# Altium schematic sheet PhaseALeg.SchDoc: Phase A
size A4; DrawnBy: Jarod Krane; Organization: Altium Limited; Address1: L3, 12a Rodborough Rd; Address2: Frenchs Forest; Address3: NSW; Address4: Australia 2086; Revision: 0; SheetNumber: 2; SheetTotal: 11
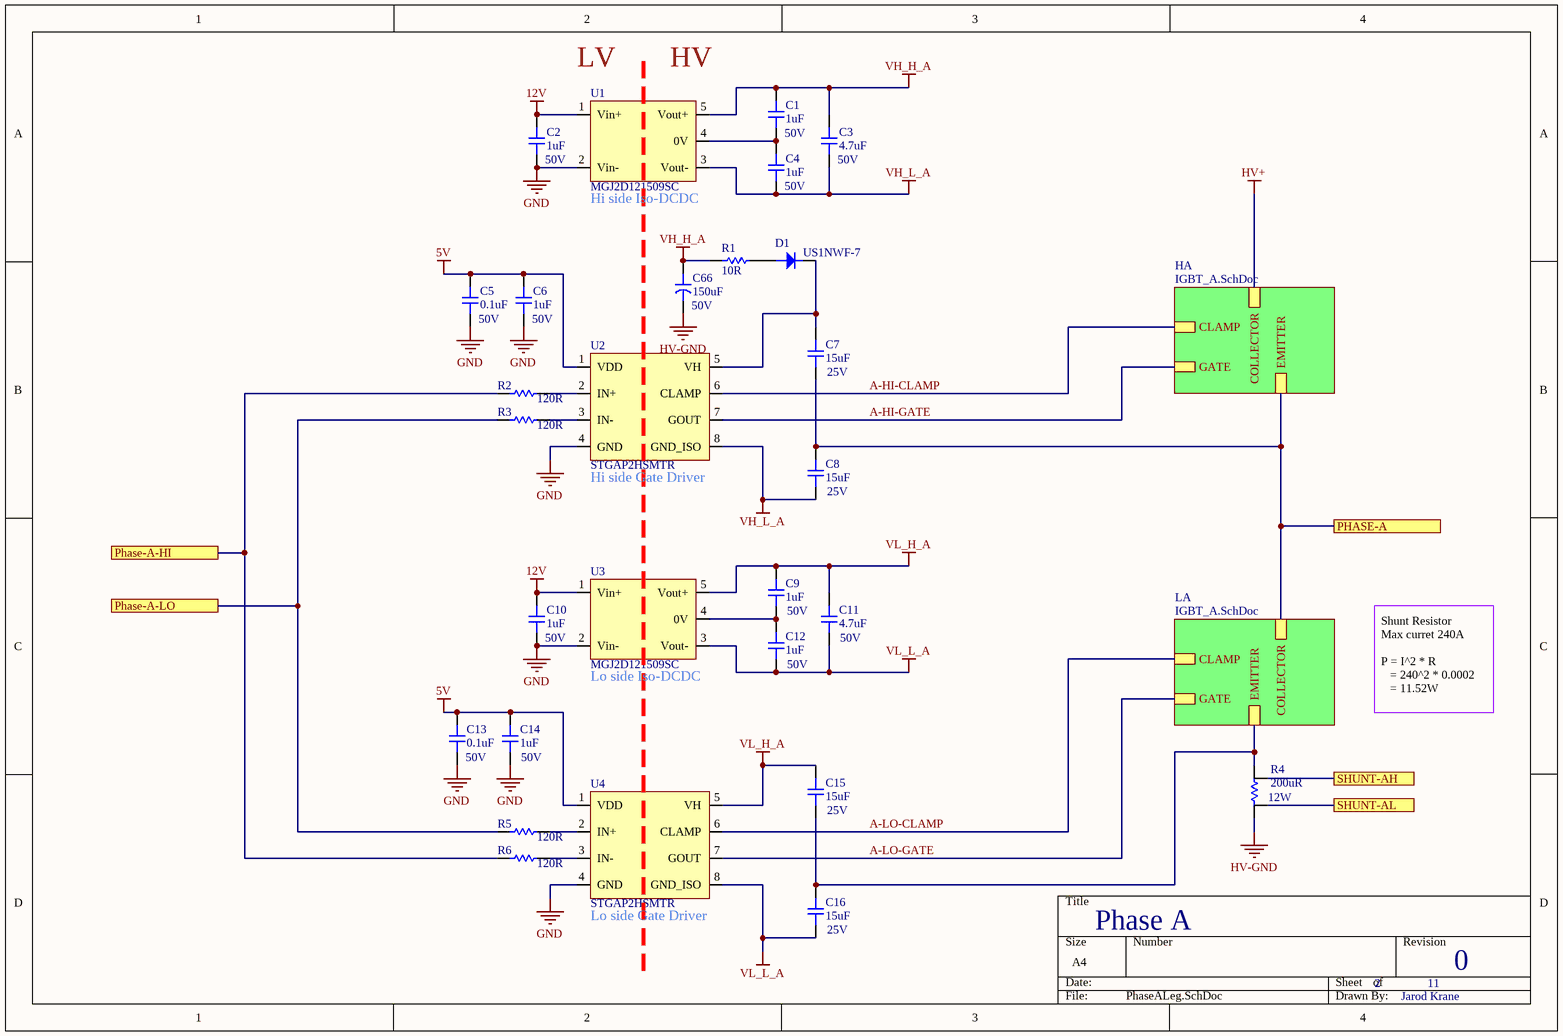
[diagram p0: PhaseALeg.SchDoc]

## Parts
C1  1uF  Voltage Rating: 50V  [CAP-0805]
C2  1uF  Voltage Rating: 50V  [CAP-0805]
C3  4.7uF  Voltage Rating: 50V  [CAP-1206]
C4  1uF  Voltage Rating: 50V  [CAP-0805]
C5  0.1uF  Voltage: 50V  [CAP-0805]
C6  1uF  Voltage Rating: 50V  [CAP-0805]
C7  15uF  Voltage: 25V  [CAP-1812]
C8  15uF  Voltage: 25V  [CAP-1812]
C9  1uF  Voltage Rating: 50V  [CAP-0805]
C10  1uF  Voltage Rating: 50V  [CAP-0805]
C11  4.7uF  Voltage Rating: 50V  [CAP-1206]
C12  1uF  Voltage Rating: 50V  [CAP-0805]
C13  0.1uF  Voltage: 50V  [CAP-0805]
C14  1uF  Voltage Rating: 50V  [CAP-0805]
C15  15uF  Voltage: 25V  [CAP-1812]
C16  15uF  Voltage: 25V  [CAP-1812]
C66  150uF  Voltage: 50V  [CAPCAN-10mm]
D1  US1NWF-7  [DIOM2718X12N]
R1  10R  [RES-0603]
R2  120R  [RES-0603]
R3  120R  [RES-0603]
R4  200uR  Power: 12W  [RES-SHUNT]
R5  120R  [RES-0603]
R6  120R  [RES-0603]
U1  MGJ2D121509SC  [MGJ2]
U2  STGAP2HSMTR  [SO-8W]
U3  MGJ2D121509SC  [MGJ2]
U4  STGAP2HSMTR  [SO-8W]

## Sub-sheets
HA = IGBT_A.SchDoc: COLLECTOR, EMITTER, GATE, CLAMP
LA = IGBT_A.SchDoc: COLLECTOR, EMITTER, GATE, CLAMP

## Ports
PHASE-A, Phase-A-HI, Phase-A-LO, SHUNT-AH, SHUNT-AL

## Nets
5V: C5.2 C6.2 C13.2 C14.2 U2.1(VDD) U4.1(VDD)
12V: C2.2 C10.2 U1.1(Vin+) U3.1(Vin+)
GND: C2.1 C5.1 C6.1 C10.1 C13.1 C14.1 U1.2(Vin-) U2.4(GND) U3.2(Vin-) U4.4(GND)
HV+: sheet HA/COLLECTOR
HV-GND: C66.2 R4.1
VH_H_A: C1.2 C3.2 C66.1 R1.1 U1.5(Vout+)
VH_L_A: C3.1 C4.1 C8.1 U1.3(Vout-) U2.8(GND_ISO)
VL_H_A: C9.2 C11.2 C15.2 U3.5(Vout+) U4.5(VH)
VL_L_A: C11.1 C12.1 C16.1 U3.3(Vout-) U4.8(GND_ISO)
A-HI-CLAMP: U2.6(CLAMP) ; sheet HA/CLAMP
A-HI-GATE: U2.7(GOUT) ; sheet HA/GATE
A-LO-CLAMP: U4.6(CLAMP) ; sheet LA/CLAMP
A-LO-GATE: U4.7(GOUT) ; sheet LA/GATE
PHASE-A: C7.1 C8.2 ; port PHASE-A, sheet HA/EMITTER, sheet LA/COLLECTOR
Phase-A-HI: R2.1 R6.1 ; port Phase-A-HI
Phase-A-LO: R3.1 R5.1 ; port Phase-A-LO
SHUNT-AH: R4.4 ; port SHUNT-AH
SHUNT-AL: R4.3 ; port SHUNT-AL
NetC1_1: C1.1 C4.2 U1.4(0V)
NetC7_2: C7.2 D1.1 U2.5(VH)
NetC9_1: C9.1 C12.2 U3.4(0V)
NetC15_1: C15.1 C16.2 R4.2 ; sheet LA/EMITTER
NetD1_2: D1.2 R1.2
NetR2_2: R2.2 U2.2(IN+)
NetR3_2: R3.2 U2.3(IN-)
NetR5_2: R5.2 U4.2(IN+)
NetR6_2: R6.2 U4.3(IN-)

## Notes on the sheet
- (near U1) LV
- (near U1) HV
- (near U1) Hi side Iso-DCDC
- (near U2) Hi side Gate Driver
- (near U3) Lo side Iso-DCDC
- Shunt Resistor
  Max curret 240A
  P = I^2 * R
  = 240^2 * 0.0002
  = 11.52W
- (near U4) Lo side Gate Driver
- Title
- Size:
- Date:
- A4
- Number:
- Time:
- Revision:
- Sheet
- of
- File:

## Library data of the parts
C1 C2 C4 C6 C9 C10 C12 C14 = 0805-1uF-50V: CAP CER 1UF 50V X5R 0805; Manufacturer: KEMET; Manufacturer Part Number: C0805C105K5PACTU; Dielectric Material: Ceramic; Tolerance: 10%; Supplier 1: Digi-Key; Stock 1: 7193; Pricing 1: 1=0.33, 10=0.23, 100=0.1378, 500=0.10334, 1000=0.08726 (USD); Mount: Surface Mount; Case/Package: 0805; Weight: 0.000194oz; Case Code (Metric): 2012; Case Code (Imperial): 0805; Min Operating Temperature: -55°C; Max Operating Temperature: 85°C; Dielectric: X5R; Packaging: Tape and Reel; Termination: SMD/SMT; Voltage Rating (DC): 50V; Package Quantity: 2500; Capacitance: 1uF; Length: 0.079inch; Width: 0.049inch; Thickness: 0.055inch; REACH SVHC: No SVHC; Lead Free: Lead Free; ComponentLink1URL: https://api.kemet.com/component-edge/download/datasheet/C0805C105K5PAC7800.pdf?src-supplier=Digi-Key; ComponentLink1Description: https://api.kemet.com/component-edge/download/datasheet/C0805C105K5PAC7800.pdf?src-supplier=Digi-Key; ComponentLink2URL: http://www.farnell.com/datasheets/2746140.pdf?src-supplier=Farnell; ComponentLink2Description: http://www.farnell.com/datasheets/2746140.pdf?src-supplier=Farnell; ComponentLink3URL: http://www.mouser.com/ds/2/212/KEM_C1006_X5R_SMD-1103249.pdf?src-supplier=Mouser; ComponentLink3Description: http://www.mouser.com/ds/2/212/KEM_C1006_X5R_SMD-1103249.pdf?src-supplier=Mouser; ComponentLink4URL: http://www.farnell.com/datasheets/2746140.pdf?src-supplier=Newark; ComponentLink4Description: http://www.farnell.com/datasheets/2746140.pdf?src-supplier=Newark; ComponentLink5URL: http://www.farnell.com/datasheets/2032728.pdf?src-supplier=Element14; ComponentLink5Description: http://www.farnell.com/datasheets/2032728.pdf?src-supplier=Element14; Supplier Part Number 1: 399-15436-6-ND
C3 C11 = 1206-4.7uF-50V: CAP CER 4.7UF 50V X7R 1206; Manufacturer: TDK; Manufacturer Part Number: C3216X7R1H475K160AC; Dielectric Material: Ceramic; Tolerance: 10%; Supplier 1: Digi-Key; Stock 1: 117540; Pricing 1: 1=0.76, 10=0.535, 50=0.4042, 100=0.3521, 500=0.26082, 1000=0.2217 (USD); Mount: Surface Mount; Case/Package: 1206; Case Code (Metric): 3216; Case Code (Imperial): 1206; Weight: 0.000571oz; Min Operating Temperature: -55°C; Max Operating Temperature: 125°C; Capacitance: 4.7uF; Packaging: Tape and Reel; Voltage Rating (DC): 50V; Termination: SMD/SMT; Series: C; Package Quantity: 1; Dielectric: X7R; Resistor Type: Ceramic; Length: 3.2mm; Width: 0.063inch; Depth: 1.6mm; Thickness: 1.6mm; REACH SVHC: No SVHC; Lead Free: Lead Free; RoHS Compliant: Yes; ComponentLink1URL: https://product.tdk.com/info/en/catalog/datasheets/mlcc_commercial_general_en.pdf?src-supplier=Digi-Key; ComponentLink1Description: https://product.tdk.com/info/en/catalog/datasheets/mlcc_commercial_general_en.pdf?src-supplier=Digi-Key; ComponentLink2URL: http://www.mouser.com/ds/2/400/lcc_commercial_general_en-560200.pdf?src-supplier=Mouser; ComponentLink2Description: http://www.mouser.com/ds/2/400/lcc_commercial_general_en-560200.pdf?src-supplier=Mouser; ComponentLink3URL: http://product.tdk.com/capacitor/mlcc/en/documents/mlcc_commercial_general_en.pdf?src-supplier=Future+Electronics; ComponentLink3Description: http://product.tdk.com/capacitor/mlcc/en/documents/mlcc_commercial_general_en.pdf?src-supplier=Future+Electronics; Supplier Part Number 1: 445-8032-6-ND
C5 C13 = 0805-0.1uF-50V: CAP CER 0.1UF 50V Y5V 0805; Manufacturer: KEMET; Manufacturer Part Number: C0805C104Z5VACTU; Dielectric Material: Ceramic; Capacitance: 100nF; Tolerance: 80%; Dissipation Factor: 5%; Supplier 1: Digi-Key; Stock 1: 929243; Pricing 1: 1=0.1, 10=0.057, 100=0.0254, 500=0.01818, 1000=0.01428 (USD); Mount: Surface Mount,PCB; Case/Package: 0805; Number of Pins: 2; Case Code (Metric): 2012; Case Code (Imperial): 0805; Min Operating Temperature: -30°C; Max Operating Temperature: 85°C; Package Quantity: 1; Voltage Rating: 50V; Packaging: Tape and Reel; Voltage Rating (DC): 50V; Dielectric: Y5V; Termination: SMD/SMT; Length: 2mm; Height: 0.9mm; Lead Pitch: 0.75mm; Width: 0.049inch; Thickness: 0.039inch; Depth: 1.25mm; Radiation Hardening: No; REACH SVHC: No SVHC; Lead Free: Lead Free; ComponentLink1URL: http://www.alliedelec.com/m/d/9bfe7773041ffe9d406e68bc7b377fdd.pdf?src-supplier=Allied+Electronics; ComponentLink1Description: http://www.alliedelec.com/m/d/9bfe7773041ffe9d406e68bc7b377fdd.pdf?src-supplier=Allied+Electronics; ComponentLink2URL: https://www.verical.com/server-webapp/html/getDatasheet?partID=37101&src-supplier=Verical; ComponentLink2Description: https://www.verical.com/server-webapp/html/getDatasheet?partID=37101&src-supplier=Verical; ComponentLink3URL: https://www.verical.com/server-webapp/html/getDatasheet?partID=321176&src-supplier=Verical; ComponentLink3Description: https://www.verical.com/server-webapp/html/getDatasheet?partID=321176&src-supplier=Verical; ComponentLink4URL: http://www.farnell.com/datasheets/2123124.pdf?src-supplier=Element14; ComponentLink4Description: http://www.farnell.com/datasheets/2123124.pdf?src-supplier=Element14; Supplier Part Number 1: 399-1177-6-ND
C7 C8 C15 C16 = 1812-15uF-25V: CAP CER 15UF 25V X7R 1812; Manufacturer: TDK; Manufacturer Part Number: C4532X7R1E156M280KB; Dielectric Material: Ceramic; Tolerance: 20%; Supplier 1: Digi-Key; Stock 1: 9166; Pricing 1: 1=1.18, 10=0.932, 50=0.8072, 100=0.6986 (USD); Mount: Surface Mount; Case/Package: 1812; Number of Pins: 2; Case Code (Imperial): 1812; Case Code (Metric): 4532; Weight: 0.000952oz; Min Operating Temperature: -55°C; Max Operating Temperature: 125°C; Voltage Rating: 25V; Capacitance: 15uF; Voltage Rating (DC): 25V; Packaging: Tape and Reel; Dielectric: X7R; Termination: SMD/SMT; Package Quantity: 1; Resistor Type: Ceramic; Series: C; Length: 4.5mm; Width: 0.126inch; Height: 2.8mm; Depth: 3.2mm; Thickness: 0.122inch; RoHS Compliant: Yes; Lead Free: Lead Free; REACH SVHC: No SVHC; ComponentLink1URL: http://www.farnell.com/datasheets/1913358.pdf?src-supplier=Element14; ComponentLink1Description: http://www.farnell.com/datasheets/1913358.pdf?src-supplier=Element14; ComponentLink2URL: https://product.tdk.com/info/en/documents/chara_sheet/C4532X7R1E156M280KB.pdf?src-supplier=Digi-Key; ComponentLink2Description: https://product.tdk.com/info/en/documents/chara_sheet/C4532X7R1E156M280KB.pdf?src-supplier=Digi-Key; ComponentLink3URL: https://product.tdk.com/en/products/common/pdf/mlcc_partnumber_description.pdf?src-supplier=Digi-Key; ComponentLink3Description: https://product.tdk.com/en/products/common/pdf/mlcc_partnumber_description.pdf?src-supplier=Digi-Key; ComponentLink4URL: http://uk.rs-online.com/webdocs/1532/0900766b81532cd0.pdf?src-supplier=RSComponents; ComponentLink4Description: http://uk.rs-online.com/webdocs/1532/0900766b81532cd0.pdf?src-supplier=RSComponents; ComponentLink5URL: http://www.tdk.com/pdf/general_B11.pdf?src-supplier=Future+Electronics; ComponentLink5Description: http://www.tdk.com/pdf/general_B11.pdf?src-supplier=Future+Electronics; Supplier Part Number 1: 445-3921-6-ND
C66 = 10mm-150uF-50V: CAP POLYMER HYBRID 150UF 50V SMD; Manufacturer: Panasonic; Manufacturer Part Number: EEHZS1H151P; Supplier 1: Digi-Key; Stock 1: 1212; Pricing 1: 1=2.07, 10=1.673, 50=1.46, 100=1.2775 (USD); Supplier Part Number 1: 10-EEH-ZS1H151PDKR-ND
D1 = Diode 1.2KV-1A: DIODE GEN PURP 1.2KV 1A SOD123F; Manufacturer: Diodes; Reverse Recovery Time: 80ns; Supplier 1: Digi-Key; Manufacturer Part Number: US1NWF-7; Stock 1: 33557; Pricing 1: 1=0.54, 10=0.438, 100=0.2985, 500=0.22388, 1000=0.1679 (USD); Mount: Surface Mount; Packaging: Tape and Reel; Max Reverse Voltage (DC): 1.2kV; Average Rectified Current: 1A; ComponentLink1URL: https://www.diodes.com/assets/Datasheets/US1NWF.pdf?src-supplier=Digi-Key; ComponentLink1Description: https://www.diodes.com/assets/Datasheets/US1NWF.pdf?src-supplier=Digi-Key; Supplier Part Number 1: US1NWF-7DIDKR-ND
R1 = 0603-10R: RES SMD 10 OHM 1% 1/10W 0603; Manufacturer: Yageo; Manufacturer Part Number: RC0603FR-0710RL; Voltage Rating (DC): 50V; Temperature Coefficient: 200ppm/°C; Power Rating: 100mW; Supplier 1: Digi-Key; Stock 1: 11151092; Pricing 1: 1=0.1, 10=0.046, 100=0.0187, 1000=0.0084, 2500=0.00729 (USD); Case/Package: 0603; Number of Pins: 2; Case Code (Imperial): 0603; Case Code (Metric): 1608; Contact Plating: Tin,Matte; Min Operating Temperature: -55°C; Max Operating Temperature: 155°C; Packaging: Tape and Reel; Resistance: 10R; Tolerance: 1%; Composition: Thick Film; Voltage Rating: 50V; Termination: SMD/SMT; Military Standard: Not; Length: 1.6mm; Height: 0.45mm; Width: 0.8mm; Depth: 0.8mm; Radiation Hardening: No; REACH SVHC: No SVHC; Lead Free: Lead Free; ComponentLink1URL: http://www.farnell.com/datasheets/1868787.pdf?src-supplier=Element14; ComponentLink1Description: http://www.farnell.com/datasheets/1868787.pdf?src-supplier=Element14; ComponentLink2URL: http://www.yageo.com/documents/recent/PYu-RC0603_51_RoHS_L_4.pdf?src-supplier=Avnet; ComponentLink2Description: http://www.yageo.com/documents/recent/PYu-RC0603_51_RoHS_L_4.pdf?src-supplier=Avnet; ComponentLink3URL: http://documents.rs-components.com/techlib://itc_doclist_GB.htm?stockno=5048984&src-supplier=RSComponents; ComponentLink3Description: http://documents.rs-components.com/techlib://itc_doclist_GB.htm?stockno=5048984&src-supplier=RSComponents; ComponentLink4URL: http://www.yageo.com/documents/recent/PYu-RC0603_51_RoHS_L_4.pdf?src-supplier=Avnet+Europe; ComponentLink4Description: http://www.yageo.com/documents/recent/PYu-RC0603_51_RoHS_L_4.pdf?src-supplier=Avnet+Europe; Supplier Part Number 1: 311-10.0HRDKR-ND
R2 R3 R5 R6 = 0603-120R: RES SMD 120 OHM 1% 1/10W 0603; Manufacturer: Yageo; Manufacturer Part Number: RC0603FR-07120RL; Voltage Rating (DC): 50V; Temperature Coefficient: 100ppm/°C; Power Rating: 100mW; Supplier 1: Digi-Key; Stock 1: 1047274; Pricing 1: 1=0.1, 10=0.023, 100=0.0094, 1000=0.00421, 2500=0.00366 (USD); Case/Package: 0603; Number of Pins: 2; Case Code (Metric): 1608; Case Code (Imperial): 0603; Min Operating Temperature: -55°C; Max Operating Temperature: 155°C; Resistance: 120R; Tolerance: 1%; Packaging: Tape and Reel; Composition: Thick Film; Voltage Rating: 50V; Package Quantity: 1; Number of Terminations: 2; Termination: SMD/SMT; Military Standard: Not; Max Power Dissipation: 100mW; Features: Moisture Resistant; Length: 1.6mm; Height: 0.022inch; Width: 0.031inch; Depth: 0.8mm; REACH SVHC: No SVHC; Lead Free: Lead Free; ComponentLink1URL: http://www.yageo.com/documents/recent/PYu-RC_Group_51_RoHS_L_10.pdf?src-supplier=Digi-Key; ComponentLink1Description: http://www.yageo.com/documents/recent/PYu-RC_Group_51_RoHS_L_10.pdf?src-supplier=Digi-Key; ComponentLink2URL: http://www.farnell.com/datasheets/2167052.pdf?src-supplier=Element14; ComponentLink2Description: http://www.farnell.com/datasheets/2167052.pdf?src-supplier=Element14; ComponentLink3URL: http://www.farnell.com/datasheets/1868787.pdf?src-supplier=Element14; ComponentLink3Description: http://www.farnell.com/datasheets/1868787.pdf?src-supplier=Element14; ComponentLink4URL: http://www.farnell.com/datasheets/443971.pdf?src-supplier=Element14; ComponentLink4Description: http://www.farnell.com/datasheets/443971.pdf?src-supplier=Element14; Supplier Part Number 1: 311-120HRDKR-ND
R4 = 3920-200uR-SHUNT: RES SMD 200 UOHM 1% 12W 3920; Manufacturer: Bourns; Manufacturer Part Number: CSS2H-3920R-L200FE; Supplier 1: Digi-Key; Stock 1: 420; Pricing 1: 1=1.6, 10=1.42, 25=1.3052, 50=1.1908, 100=1.0305, 250=0.8702, 500=0.7328 (USD); RoHS Compliant: Yes; ComponentLink1URL: https://www.bourns.com/docs/Product-Datasheets/css2h-3920.pdf?src-supplier=Digi-Key; ComponentLink1Description: https://www.bourns.com/docs/Product-Datasheets/css2h-3920.pdf?src-supplier=Digi-Key; Supplier Part Number 1: CSS2H-3920R-L200FEDKR-ND
U1 U3 = 15V/-8.7V: Isolated Module DC DC Converter Output 15V -8.7V - 80mA, 40mA 10.8V - 13.2V Input; Manufacturer: Murata; Number of Outputs: 2; Output Power: 2W; Isolation Voltage: 5.2kV; Efficiency: 80%; Nominal Input Voltage: 12V; Supplier 1: Digi-Key; Manufacturer Part Number: MGJ2D121509SC; Stock 1: 371; Pricing 1: 1=8.46, 5=8.42, 10=8.36, 25=8.27, 50=8.06, 100=7.66, 250=7.17, 500=6.68, 1000=6.65 (USD); Mount: Through Hole; Case/Package: SIP; Number of Pins: 5; Weight: 0.151678oz; Min Operating Temperature: -40°C; Max Operating Temperature: 100°C; Max Input Voltage: 13.2V; Min Input Voltage: 10.8V; Packaging: Rail/Tube; Max Input Voltage (DC): 13.2V; Min Input Voltage (DC): 10.8V; Voltage - Output 1: 15V; Voltage - Output 2: -8.7V; Max Output Current: 40mA; Current - Output 1: 80mA; Current - Output 2: 40mA; Max Output Power: 2W; Output Voltage: 15V; Output Current: 80mA; Max Power Dissipation: 2W; Package Quantity: 25; Features: SCP; Length: 0.77inch; Width: 0.39inch; Height: 0.5inch; Depth: 12.65mm; Radiation Hardening: No; REACH SVHC: No SVHC; RoHS Compliant: Yes; ComponentLink1URL: http://www.farnell.com/datasheets/1965123.pdf?src-supplier=Element14; ComponentLink1Description: http://www.farnell.com/datasheets/1965123.pdf?src-supplier=Element14; ComponentLink2URL: http://power.murata.com/data/power/ncl/kdc_mgj2.pdf?src-supplier=Avnet; ComponentLink2Description: http://power.murata.com/data/power/ncl/kdc_mgj2.pdf?src-supplier=Avnet; Supplier Part Number 1: 811-3002-5-ND
U2 U4 = STGAP2HSMTR: GALVANICALLY ISOLATED 4 A SINGLE GATE DRIVER; Manufacturer: Samtec; Manufacturer Part Number: ERF8-010-07.0-L-DV-L-K-TR; Supplier 1: Digi-Key; Stock 1: 498; Pricing 1: 1=3.01, 10=2.699, 25=2.5516, 100=2.2113, 250=2.09788, 500=1.88242 (USD); Supplier Part Number 1: 497-STGAP2HSMDKR-ND